# Altium project ESC30A.PrjPcb (part 2 of 2)
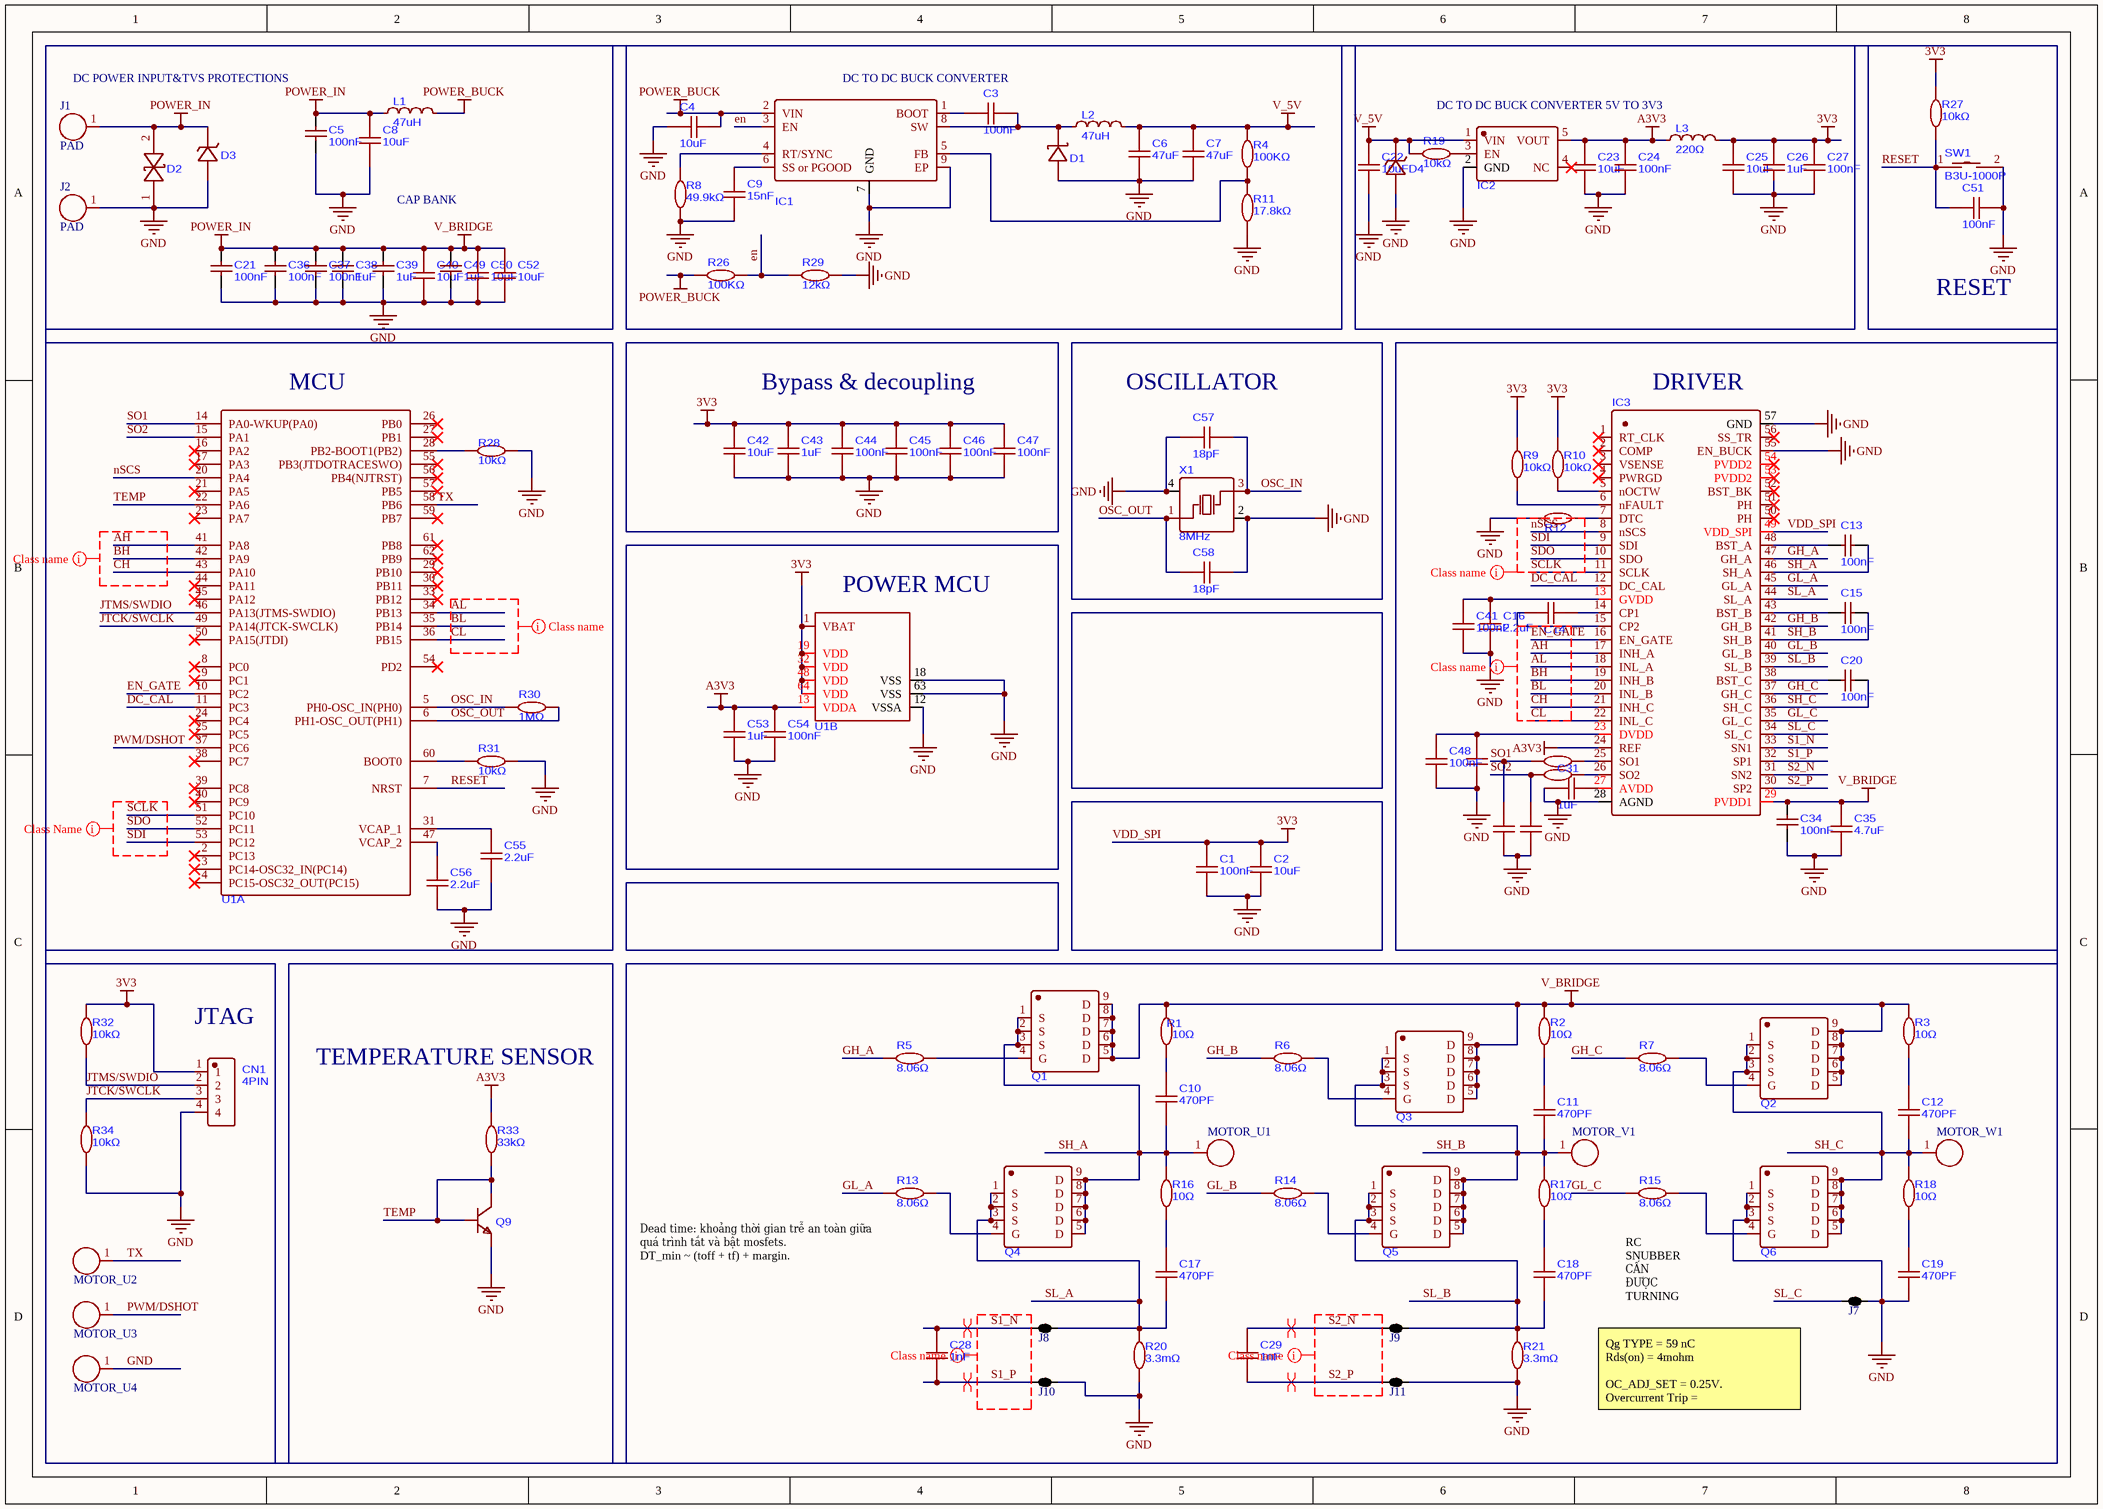
[diagram p1: ESC.SchDoc]

## Sheet ESC.SchDoc (continued)

### Parts
C1  100nF  [C0603]
C2  10uF  [C0603]
C3  100nF  [C0603]
C4  10uF  [C1206]
C5  100nF  [C0805]
C6  47uF  [C0603]
C7  47uF  [C0603]
C8  10uF  [C1206]
C9  15nF  [C0603]
C10  470PF  [C0805]
C11  470PF  [C0805]
C12  470PF  [C0805]
C13  100nF  [C0805]
C14  220nF  [C0603]  (value not drawn)
C15  100nF  [C0805]
C16  2.2uF  [C0603]
C17  470PF  [C0805]
C18  470PF  [C0805]
C19  470PF  [C0805]
C20  100nF  [C0805]
C21  100nF  [C0805]
C22  10uF  [C0603]
C23  10uF  [C0603]
C24  100nF  [C0603]
C25  10uF  [C0603]
C26  1uF  [C0603]
C27  100nF  [C0603]
C28  1nF  [C0603]
C29  1nF  [C0603]
C30  1uF  [C0603]  (value not drawn)
C31  1uF  [C0603]
C32  2.2uF  [C0603]  (value not drawn)
C33  2.2uF  [C0603]  (value not drawn)
C34  100nF  [C0805]
C35  4.7uF  [C0805]
C36  100nF  [C0805]
C37  100nF  [C0805]
C38  1uF  [C0805]
C39  1uF  [C0805]
C40  10uF  [C1206]
C41  100nF  [C0603]
C42  10uF  [C0603]
C43  1uF  [C0603]
C44  100nF  [C0603]
C45  100nF  [C0603]
C46  100nF  [C0603]
C47  100nF  [C0603]
C48  100nF  [C0603]
C49  1uF  [C0805]
C50  10uF  [C1206]
C51  100nF  [C0603]
C52  10uF  [C1206]
C53  1uF  [C0603]
C54  100nF  [C0603]
C55  2.2uF  [C0603]
C56  2.2uF  [C0603]
C57  18pF  [C0603]
C58  18pF  [C0603]
CN1  4PIN  [HDR-TH_4P-HX-PH254-01-04-Z-L11.5]
D1  DIODE SCHOTTKY 100V SMA(DO-214AC)  [SMA_L4.3-W2.6-LS5.2-RD]  (value not drawn)
D2  TVS DIODE 54VWM 87.1VC DO-214AB(SMCJ)  [SMB_L4.6-W3.6-LS5.3-BI]  (value not drawn)
D3  DIODE ZENER 56V 500mW SOD-123W  [SOD-123_L2.8-W1.8-LS3.7-RD]  (value not drawn)
D4  DIODE ZENER 5.6V 500mW LL-34  [LL-34_L3.5-W1.5-RD]  (value not drawn)
IC1  60V 3A Step-Down Converter  [SOIC-8_L4.9-W3.9-P1.27-LS6.0-BL-EP2.3]  (value not drawn)
IC2  500mA Low-Noise LDo Voltage Regulator  [SOT-23-5_L2.9-W1.6-P0.95-LS2.8-BR]  (value not drawn)
IC3  DRV8301 Three-Phase Gate Driver With Dual Current Shunt Amplifiers and Buck Regulator  [HTSSOP-56_L14.0-W6.0-P0.50-LS8.1-BL-EP]  (value not drawn)
J1  PAD  [PAD]
J2  PAD  [PAD]
J7  2 way net tie junction  [2way_LP]  (value not drawn)  (net tie, no BOM)
J8  2 way net tie junction  [2way_LP]  (value not drawn)  (net tie, no BOM)
J9  2 way net tie junction  [2way_LP]  (value not drawn)  (net tie, no BOM)
J10  2 way net tie junction  [2way_LP]  (value not drawn)  (net tie, no BOM)
J11  2 way net tie junction  [2way_LP]  (value not drawn)  (net tie, no BOM)
L1  47uH  [IND-SMD_L5.0-W5.0_FNR50XXS]
L2  47uH  [IND-SMD_L5.0-W5.0_FNR50XXS]
L3  220Ω  [C0805]
MOTOR_U1  PAD  [PAD]  (value not drawn)
MOTOR_U2  PAD  [PAD]  (value not drawn)
MOTOR_U3  PAD  [PAD]  (value not drawn)
MOTOR_U4  PAD  [PAD]  (value not drawn)
MOTOR_V1  PAD  [PAD]  (value not drawn)
MOTOR_W1  PAD  [PAD]  (value not drawn)
Q1  MOSFET N-CH 80V 100A SOP-8-Advance  [SOP-8_L5.0-W5.0-P1.27-LS6.0_TPH4R008NH-L1Q]  (value not drawn)
Q2  MOSFET N-CH 80V 100A SOP-8-Advance  [SOP-8_L5.0-W5.0-P1.27-LS6.0_TPH4R008NH-L1Q]  (value not drawn)
Q3  MOSFET N-CH 80V 100A SOP-8-Advance  [SOP-8_L5.0-W5.0-P1.27-LS6.0_TPH4R008NH-L1Q]  (value not drawn)
Q4  MOSFET N-CH 80V 100A SOP-8-Advance  [SOP-8_L5.0-W5.0-P1.27-LS6.0_TPH4R008NH-L1Q]  (value not drawn)
Q5  MOSFET N-CH 80V 100A SOP-8-Advance  [SOP-8_L5.0-W5.0-P1.27-LS6.0_TPH4R008NH-L1Q]  (value not drawn)
Q6  MOSFET N-CH 80V 100A SOP-8-Advance  [SOP-8_L5.0-W5.0-P1.27-LS6.0_TPH4R008NH-L1Q]  (value not drawn)
Q9  TRANS NPN 40V 200mA SOT-416  [SC-75-3_L1.6-W0.8-P1.00-LS1.6-BR]  (value not drawn)
R1  10Ω  [R0805]
R2  10Ω  [R0805]
R3  10Ω  [R0805]
R4  100KΩ  [R0603]
R5  8.06Ω  [R1206]
R6  8.06Ω  [R1206]
R7  8.06Ω  [R1206]
R8  49.9kΩ  [R0603]
R9  10kΩ  [R0603]
R10  10kΩ  [R0603]
R11  17.8kΩ  [R0603]
R12  24.9KΩ  [R0603]  (value not drawn)
R13  8.06Ω  [R1206]
R14  8.06Ω  [R1206]
R15  8.06Ω  [R1206]
R16  10Ω  [R0805]
R17  10Ω  [R0805]
R18  10Ω  [R0805]
R19  10kΩ  [R0603]
R20  3.3mΩ  [R2512]
R21  3.3mΩ  [R2512]
R22  56Ω  [R0603]  (value not drawn)
R23  56Ω  [R0603]  (value not drawn)
R26  100KΩ  [R0603]
R27  10kΩ  [R0603]
R28  10kΩ  [R0603]
R29  12kΩ  [R0603]
R30  1MΩ  [R0603]
R31  10kΩ  [R0603]
R32  10kΩ  [R0603]
R33  33kΩ  [R0603]
R34  10kΩ  [R0603]
SW1  B3U-1000P  [KEY-SMD_B3U-1000PM]
U1  ARM Cortex-M4 32b MCU+FPU, 210DMIPS, up to 1MB Flash/192+4KB RAM, USB OTG HS/FS, Ethernet, 17 TIMs, 3 ADCs, 15 comm. interfaces & camera  [LQFP-64_L10.0-W10.0-P0.50-LS12.0-BL]  (value not drawn)  (parts A,B of 2)
X1  8MHz  [OSC-SMD_4P-L5.0-W3.2-BL]

### Nets
A3V3: C23.2 C24.2 C53.2 C54.2 IC2.5(VOUT) IC3.24(REF) L3.1 R33.2 U1.13(VDDA)
GND: C1.1 C2.1 C4.2 C5.1 C6.1 C7.1 C8.1 C9.1 C16.1 C19.1 C21.1 C22.1 C23.1 C24.1 C25.1 C26.1 C27.1 C30.1 C31.2 C32.1 C33.1 C34.1 C35.1 C36.1 C37.1 C38.1 C39.1 C40.1 C41.1 C42.1 C43.1 C44.1 C45.1 C46.1 C47.1 C48.1 C49.1 C50.1 C51.2 C52.1 C53.1 C54.1 C55.1 C56.1 C57.1 C58.2 CN1.4 D1.2(A) D2.1 D3.2(A) D4.2(A) IC1.7(GND) IC1.9(EP) IC2.2(GND) IC3.28(AGND) IC3.55(EN_BUCK) IC3.57(GND) J2.1 J7.2 J10.2 J11.2 MOTOR_U4.1 Q6.1(S) Q6.2(S) Q6.3(S) Q9.2(E) R8.1 R11.2 R12.1 R20.1 R21.1 R28.2 R29.1 R31.1 R34.1 SW1.2 U1.12(VSSA) U1.18(VSS) U1.63(VSS) X1.2(GND) X1.4(GND)
POWER_BUCK: C4.1 IC1.2(VIN) L1.2 R26.2
POWER_IN: C5.2 C8.2 C21.2 C34.2 C35.2 C36.2 C37.2 C38.2 C39.2 C40.2 C49.2 C50.2 C52.2 D2.2 D3.1(K) IC3.29(PVDD1) J1.1 L1.1 Q1.5(D) Q1.6(D) Q1.7(D) Q1.8(D) Q1.9(D) Q2.5(D) Q2.6(D) Q2.7(D) Q2.8(D) Q2.9(D) Q3.5(D) Q3.6(D) Q3.7(D) Q3.8(D) Q3.9(D) R1.2 R2.2 R3.2  [also labelled V_BRIDGE]
V_5V: C6.2 C7.2 C22.2 D4.1(K) IC2.1(VIN) L2.2 R4.2 R19.2
VDD_SPI: C1.2 C2.2 C25.2 C26.2 C27.2 C42.2 C43.2 C44.2 C45.2 C46.2 C47.2 CN1.1 IC3.49(VDD_SPI) L3.2 R9.2 R10.1 R27.2 R32.2 U1.1(VBAT) U1.19(VDD) U1.32(VDD) U1.48(VDD) U1.64(VDD)  [also labelled 3V3]
AH: IC3.17(INH_A) U1.41(PA8)
AL: IC3.18(INL_A) U1.34(PB13)
BH: IC3.19(INH_B) U1.42(PA9)
BL: IC3.20(INL_B) U1.35(PB14)
CH: IC3.21(INH_C) U1.43(PA10)
CL: IC3.22(INL_C) U1.36(PB15)
DC_CAL: IC3.12(DC_CAL) U1.11(PC3)
en: IC1.3(EN) R26.1 R29.2
EN_GATE: IC3.16(EN_GATE) U1.10(PC2)
GH_A: IC3.47(GH_A) R5.1
GH_B: IC3.42(GH_B) R6.1
GH_C: IC3.37(GH_C) R7.1
GL_A: IC3.45(GL_A) R13.1
GL_B: IC3.40(GL_B) R14.1
GL_C: IC3.35(GL_C) R15.1
JTCK/SWCLK: CN1.3 R34.2 U1.49(PA14(JTCK-SWCLK))
JTMS/SWDIO: CN1.2 R32.1 U1.46(PA13(JTMS-SWDIO))
nSCS: IC3.8(nSCS) U1.20(PA4)
OSC_IN: C57.2 R30.2 U1.5(PH0-OSC_IN(PH0)) X1.3(OSC2)
OSC_OUT: C58.1 R30.1 U1.6(PH1-OSC_OUT(PH1)) X1.1(OSC1)
PWM/DSHOT: MOTOR_U3.1 U1.37(PC6)
RESET: C51.1 R27.1 SW1.1 U1.7(NRST)
S1_N: C28.2 IC3.33(SN1) J8.1
S1_P: C28.1 IC3.32(SP1) J10.1
S2_N: C29.2 IC3.31(SN2) J9.1
S2_P: C29.1 IC3.30(SP2) J11.1
SCLK: IC3.11(SCLK) U1.51(PC10)
SDI: IC3.9(SDI) U1.53(PC12)
SDO: IC3.10(SDO) U1.52(PC11)
SH_A: C10.1 C13.2 IC3.46(SH_A) MOTOR_U1.1 Q1.1(S) Q1.2(S) Q1.3(S) Q4.5(D) Q4.6(D) Q4.7(D) Q4.8(D) Q4.9(D) R16.2
SH_B: C11.1 C15.2 IC3.41(SH_B) MOTOR_V1.1 Q3.1(S) Q3.2(S) Q3.3(S) Q5.5(D) Q5.6(D) Q5.7(D) Q5.8(D) Q5.9(D) R17.2
SH_C: C12.1 C20.2 IC3.36(SH_C) MOTOR_W1.1 Q2.1(S) Q2.2(S) Q2.3(S) Q6.5(D) Q6.6(D) Q6.7(D) Q6.8(D) Q6.9(D) R18.2
SL_A: C17.1 IC3.44(SL_A) J8.2 Q4.1(S) Q4.2(S) Q4.3(S) R20.2
SL_B: C18.1 IC3.39(SL_B) J9.2 Q5.1(S) Q5.2(S) Q5.3(S) R21.2
SL_C: IC3.34(SL_C) J7.1
SO1: C32.2 R22.2 U1.14(PA0-WKUP(PA0))
SO2: C33.2 R23.2 U1.15(PA1)
TEMP: Q9.1(B) Q9.3(C) R33.1 U1.22(PA6)
TX: MOTOR_U2.1 U1.58(PB6)
NetC3_1: C3.1 D1.1(K) IC1.8(SW) L2.1
NetC3_2: C3.2 IC1.1(BOOT)
NetC9_2: C9.2 IC1.6(SS_or_PGOOD)
NetC10_2: C10.2 R1.1
NetC11_2: C11.2 R2.1
NetC12_2: C12.2 R3.1
NetC13_1: C13.1 IC3.48(BST_A)
NetC14_1: C14.1 IC3.15(CP2)
NetC14_2: C14.2 IC3.14(CP1)
NetC15_1: C15.1 IC3.43(BST_B)
NetC16_2: C16.2 C41.2 IC3.13(GVDD)
NetC17_2: C17.2 R16.1
NetC18_2: C18.2 R17.1
NetC19_2: C19.2 R18.1
NetC20_1: C20.1 IC3.38(BST_C)
NetC30_2: C30.2 C48.2 IC3.23(DVDD)
NetC31_1: C31.1 IC3.27(AVDD)
NetC55_2: C55.2 U1.31(VCAP_1)
NetC56_2: C56.2 U1.47(VCAP_2)
NetIC1_4: IC1.4(RT/SYNC) R8.2
NetIC1_5: IC1.5(FB) R4.1 R11.1
NetIC2_3: IC2.3(EN) R19.1
NetIC3_5: IC3.5(nOCTW) R10.2
NetIC3_6: IC3.6(nFAULT) R9.1
NetIC3_7: IC3.7(DTC) R12.2
NetIC3_25: IC3.25(SO1) R22.1
NetIC3_26: IC3.26(SO2) R23.1
NetQ1_4: Q1.4(G) R5.2
NetQ2_4: Q2.4(G) R7.2
NetQ3_4: Q3.4(G) R6.2
NetQ4_4: Q4.4(G) R13.2
NetQ5_4: Q5.4(G) R14.2
NetQ6_4: Q6.4(G) R15.2
NetR28_1: R28.1 U1.28(PB2-BOOT1(PB2))
NetR31_2: R31.2 U1.60(BOOT0)

Not connected (* = marked no-connect by the designer): IC2 4(NC)*; IC3 1(RT_CLK)* 2(COMP)* 3(VSENSE)* 4(PWRGD)* 50(PH)* 51(PH)* 52(BST_BK)* 53(PVDD2)* 54(PVDD2)* 56(SS_TR)*; U1 2(PC13)* 3(PC14-OSC32_IN(PC14))* 4(PC15-OSC32_OUT(PC15))* 8(PC0)* 9(PC1)* 16(PA2)* 17(PA3)* 21(PA5)* 23(PA7)* 24(PC4)* 25(PC5)* 26(PB0)* 27(PB1)* 29(PB10)* 30(PB11)* 33(PB12)* 38(PC7)* 39(PC8)* 40(PC9)* 44(PA11)* 45(PA12)* 50(PA15(JTDI))* 54(PD2)* 55(PB3(JTDOTRACESWO))* 56(PB4(NJTRST))* 57(PB5)* 59(PB7)* 61(PB8)* 62(PB9)*

### Layout directives
net class CSAI: S1_N, S1_P, S2_N, S2_P
net class SPI3: nSCS, SCLK, SDI, SDO
net class TIME1: AH, AL, BH, BL, CH, CL, EN_GATE
differential pair; differential pair class DIFF: S1_N, S1_P, S2_N, S2_P

### Notes on the sheet
- DC POWER INPUT&TVS PROTECTIONS
- DC TO DC BUCK CONVERTER
- DC TO DC BUCK CONVERTER 5V TO 3V3
- CAP BANK
- RESET
- (near U1) MCU
- Bypass & decoupling
- (near C57) OSCILLATOR
- (near IC3) DRIVER
- (near U1) POWER MCU
- (near CN1) JTAG
- TEMPERATURE SENSOR
- (near R15) RC SNUBBER CẤN ĐƯỢC TURNING THEO TẦN SỐ RINGING ĐO ĐƯỢC.
- (near R13) Dead time: khoảng thời gian trễ an toàn giữa quá trình tắt và bật mosfets.
  DT_min ~ (toff + tf) + margin.
- Qg TYPE = 59 nC
  Rds(on) = 4mohm
  OC_ADJ_SET = 0.25V.
  Overcurrent Trip = OC_ADJ_SET/Rdss = 60A
  Gain option 10V/V
  current shunt amplifiers to measure  = 50A.
  RSENSE = 3.3mohm

### Library data of the parts
C1 C3 C24 C27 C41 C44-C48 C51 C54 = CC0603KRX7R9BB104: 100nF ±10% 50V Ceramic Capacitor X7R 0603
C2 C22 C23 C25 C42 = CL10A106KP8NNNC: 10uF ±10% 10V Ceramic Capacitor X5R 0603
C4 C8 C40 C50 C52 = C3216X6S2A106KT0A0E: 10uF X6S ±10% 100V 1206 Ceramic Capacitors RoHS
C5 C13 C15 C20 C21 C34 C36 C37 = CL21B104KCFNNNE: 100nF ±10% 100V Ceramic Capacitor X7R 0805
C6 C7 = GRM21BR61A476ME15L_1: 47uF ±20% 10V Ceramic Capacitor X5R 0805
C9 = CC0603KRX7R9BB153: 10uF ±10% 10V Ceramic Capacitor X5R 0603
C10-C12 C17-C19 = CC0805KRX7R0BB103: 10nF ±10% 100V Ceramic Capacitor X7R 0805
C14 = CL10B224KA8NNNC: 220nF ±10% 25V Ceramic Capacitor X7R 0603
C16 C32 C33 C55 C56 = CC0603X5R25V225KN: 2.2uF X5R ±10% 25V 0603 Ceramic Capacitors RoHS
C26 C30 C31 C43 C53 = CL10B105KA8NNNC: 1uF ±10% 25V Ceramic Capacitor X7R 0603
C28 C29 = CC0603KRX7R9BB102: 1nF ±10% 50V Ceramic Capacitor X7R 0603
C35 = CIA0805X5R475K101MT: 4.7uF ±10% 100V Ceramic Capacitor X5R 0805
C38 C39 C49 = CGA0805X7R105K101MT: 1uF ±10% 100V Ceramic Capacitor X7R 0805
C57 C58 = CL10C180JB8NNNC: 18pF ±5% 50V Ceramic Capacitor C0G 0603
CN1 = HX PH254-01-04-Z-L11.5 STRAIGHT PIN HEADER: Pin Header 1 2.5mm 6mm -40℃~+105℃ 3mm 4P 2.54mm 3A 1kV 1x4P Through Hole,P=2.54mm Headers, Male Pins RoHS
D1 = SS210: Diode 100V 2A Surface Mount SMA(DO-214AC)
D2 = VISHAY SMCJ54A-E3/57T: 87.1VC Clamp 17.2A Ipp TVS DIODE DO-214AB(SMCJ)
D3 = BZT52C56: Zener Diode Independent 56V 500mW Surface Mount SOD-123W
D4 = ZMM5V6_C707195: Zener Diode Independent 5.6V 500mW Surface Mount LL-34
IC1 = LMR16030SDDAR: 2.5MHz Buck Adjustable 800mV~50V 3A 4.3V~60V SO-8-EP Voltage Regulators - DC DC Switching Regulators RoHS
IC2 = SPX3819M5-L-3-3: 3.3V 16V Positive Fixed SOT-23-5 Voltage Regulators - Linear, Low Drop Out (LDO) Regulators RoHS
IC3 = DRV8301DCA: MOSFET 1.7A 2.3A HTSSOP-56-EP-6mm Motor Drivers, Controllers RoHS
J7-J11 = 2way: ComponentLink1URL: http://www.edatools.cz/addons; ComponentLink1Description: Source; FootprintNote: LP=12mil, MP=40mil, HP=120mil
L1 L2 = FNR5040S470MT: 1.15A 47uH ±20% 1.2A 354mΩ Magnetic Shielded Inductor SMD,5x5mm Fixed Inductors RoHS
L3 = BLM21PG221SN1D: 220Ω@100MHz 1 Line Ferrite Bead 0805 2A 45mΩ
Q1-Q6 = TPH4R008NH,L1Q(M: N-Channel 80V 100A 78W SOP-8-Advance
Q9 = MMBT3904TT1G: Bipolar (BJT) Transistor NPN 40V 200mA 300MHz 200mW Surface Mount SOT-416
R1-R3 R16-R18 = CRCW080510R0FKEAHP: 10Ω 500mW Thick Film Resistor ±100ppm/℃ ±1% 0805 Chip Resistor - Surface Mount RoHS
R4 R26 = RC0603FR-07100KL: 100mW 100kΩ 75V Thick Film Resistor ±100ppm/℃ ±1% 0603 Chip Resistor - Surface Mount RoHS
R5-R7 R13-R15 = FRC1206F8R06TS: 8.06Ω ±1% 250mW 1206 Thick Film Resistor
R8 = RC0603FR-0749K9L: 100mW 49.9kΩ 75V Thick Film Resistor ±100ppm/℃ ±1% 0603 Chip Resistor - Surface Mount RoHS
R9 R10 R19 R27 R28 R31 R32 R34 = RC0603FR-0710KL: 100mW 10kΩ 75V ±100ppm/℃ Thick Film Resistor ±1% 0603 Chip Resistor - Surface Mount ROHS
R11 = 0603WAF1782T5E: 17.8kΩ ±1% 100mW 0603 Thick Film Resistor
R12 = FRC0603F2492TS: 24.9kΩ ±1% 100mW 0603 Thick Film Resistor
R20 R21 = WSLP25123L300FEA: 3.3mΩ 3W Current Sense Resistor ±1% ±150ppm/℃ 2512 Chip Resistor - Surface Mount RoHS
R22 R23 = FRC0603F56R0TS: 56Ω ±1% 100mW 0603 Thick Film Resistor
R29 = RC0603FR-0712KL: 12kΩ 100mW 75V Thick Film Resistor ±100ppm/℃ ±1% 0603 Chip Resistor - Surface Mount RoHS
R30 = RC0603FR-071ML: 100mW 1MΩ 75V Thick Film Resistor ±100ppm/℃ ±1% 0603 Chip Resistor - Surface Mount RoHS
R33 = RC0603FR-0733KL: 100mW 33kΩ 75V Thick Film Resistor ±100ppm/℃ ±1% 0603 Chip Resistor - Surface Mount RoHS
SW1 = B3U-1000P: 12V 2.5mm Round Button 3mm SPST 50mA SMD,3x2.5mm Tactile Switches ROHS
U1 = STM32F405RGT6: ARM Cortex-M4 32 Bit 168MHz 51 LQFP-64(10x10) Microcontrollers RoHS
X1 = ABM3B-8.000MHZ-10-1-U-T: Crystal 8MHz ±10ppm 10pF 200Ω SMD5032-4P